# EAGLE board Trackerv4 (EAGLE 9.4.2)
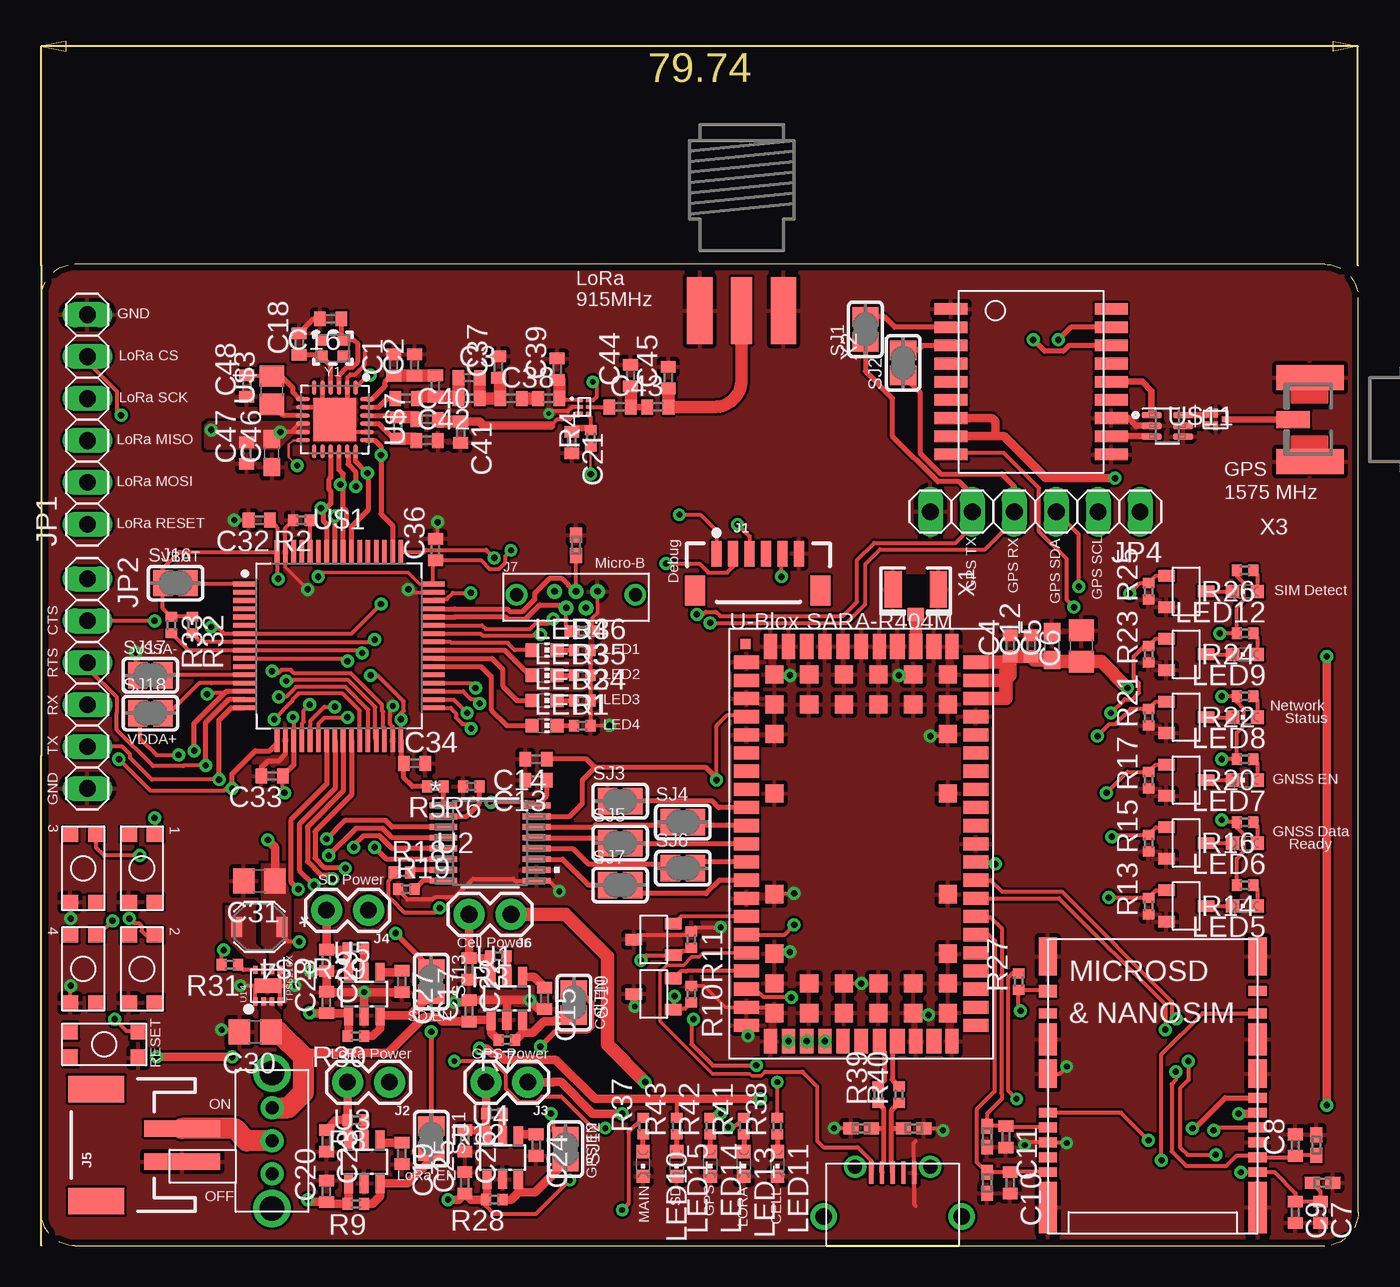
[diagram p5: board, top side]
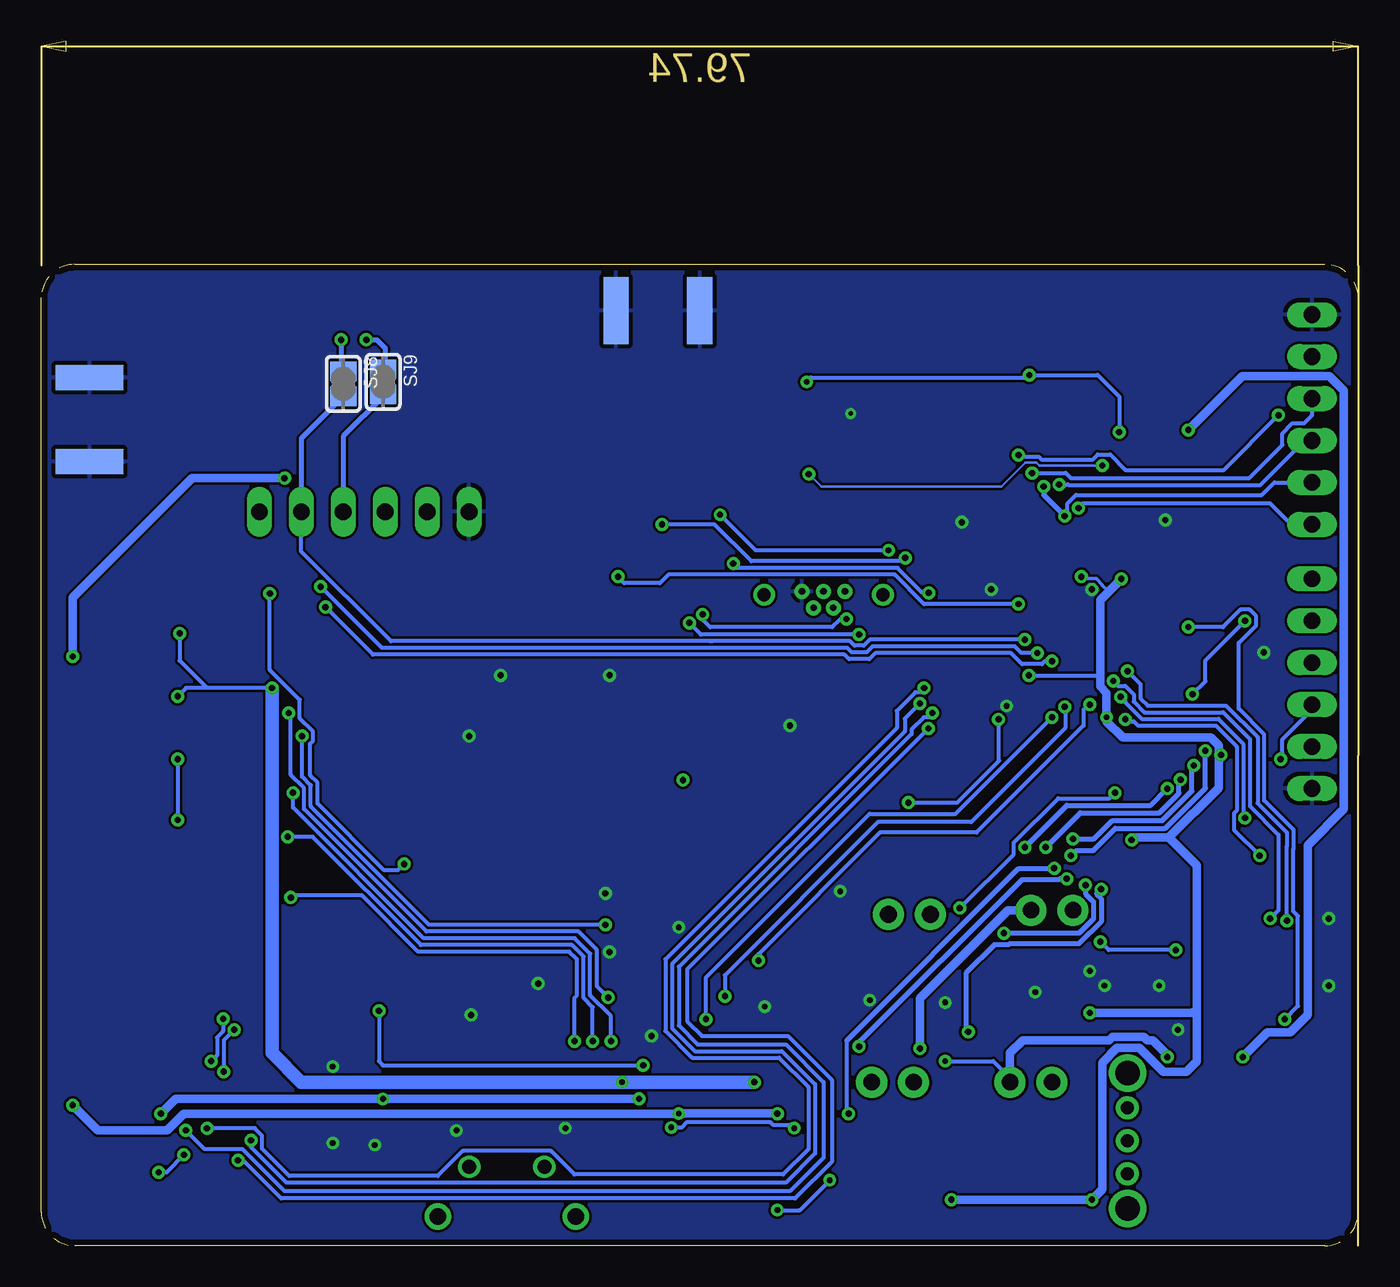
[diagram p6: board, bottom side, seen from below]

Size 79.76 x 59.44 mm. Coordinates in mm from the lower left corner, seen from the top.
Outline: 2.03,0 77.72,0 arc90 79.76,2.03 79.76,57.4 arc90 77.72,59.44 2.03,59.44 arc90 0,57.4 0,2.03 arc90 2.03,0
Copper layers (1*16): Top 0.035mm / dielectric 1.5mm / Bottom 0.035mm
Design rules "default *": minimum track width 6mil, minimum drill 0.35mm, track to track 6mil, track to pad 6mil, pad to pad 6mil, via to via 6mil, smd to smd 6mil, copper to edge 15mil, drill to drill 6mil, minimum pad ring 10mil, minimum via ring 8mil, stop-mask expansion 4mil, vias tented up to drill 0mil, thermal gap 10mil
Net classes: 1 diff: width 0.305 mm, clearance 0.152 mm

## Footprints (pad centres in the part's own frame; a part is rotated, then mirrored left to right if it is on the bottom)
C0402 = smd 0.7 x 0.9: 1 -0.65,0; 2 0.65,0
C0603 = smd 1.1 x 1: 1 -0.85,0; 2 0.85,0
C0805 = smd 1.3 x 1.5: 1 -0.95,0; 2 0.95,0
PESD0402 = smd 0.902 x 0.711: 1 -0.629,0; 2 0.629,0
JST-6-SMD-VERT-1.0MM = smd 0.6 x 1.55: 1 -2.54,1.27; 2 -1.54,1.27; 3 -0.54,1.27; 4 0.46,1.27; 5 1.46,1.27; 6 2.46,1.27 | smd 1.2 x 1.8: P$1 -3.84,-0.955; P$2 3.76,-0.955
1X02 = drill 1.016 pad 1.88: 1 0,0; 2 2.54,0
JST-2-SMD = smd 1 x 4.6: 1 -1,-3.7; 2 1,-3.7 | smd 1.6 x 3.4: NC1 -3.4,1.5; NC2 3.4,1.5
MICRO_USB_VERTICAL = drill 0.4: 1 -1.3,0; 2 -0.6,-1; 3 0,0; 4 0.6,-1; 5 1.3,0 | drill 0.8: 6 -3.6,-0.2; 7 3.6,-0.2
1X06 = drill 1.016 long: 1 -6.35,0; 2 -3.81,0; 3 -1.27,0; 4 1.27,0; 5 3.81,0; 6 6.35,0
CHIP-LED0603 = smd 0.8 x 0.8: A 0,-0.75; C 0,0.75
CHIPLED_0603 = smd 0.8 x 0.8: A 0,-0.75; C 0,0.75
SOT23-3 = smd 0.7 x 1: 1 -0.95,-1.2; 2 0.95,-1.2; 3 0,1.2
R0402 = smd 0.6 x 0.7: 1 -0.5,0; 2 0.5,0
KMR731NG = smd 0.9 x 1: P$1 -2.05,0.8; P$2 2.05,0.8; P$3 2.05,-0.8; P$4 -2.05,-0.8
SOLDERJUMPER_CLOSEDWIRE = smd 1.168 x 1.6: 1 -0.762,0; 2 0.762,0 | smd 0.635 x 0.203: WIRE 0,0
SOLDERJUMPER_REFLOW = smd 1.168 x 1.6: 1 -0.762,0; 2 0.762,0
SOLDERJUMPER_REFLOW_NOPASTE = smd 1.168 x 1.6: 1 -0.762,0; 2 0.762,0
SOT23-6 = smd 0.55 x 1.2: 1 -0.95,-1.3; 2 0,-1.3; 3 0.95,-1.3; 4 0.95,1.3; 5 0,1.3; 6 -0.95,1.3
PW16 = smd 1.676 x 0.356: 1 -2.819,2.275; 2 -2.819,1.625; 3 -2.819,0.975; 4 -2.819,0.325; 5 -2.819,-0.325; 6 -2.819,-0.975; 7 -2.819,-1.625; 8 -2.819,-2.275; 9 2.819,-2.275; 10 2.819,-1.625; 11 2.819,-0.975; 12 2.819,-0.325; 13 2.819,0.325; 14 2.819,0.975; 15 2.819,1.625; 16 2.819,2.275
SARA-R404M = smd 1.5 x 0.8: 1 1.05,-2; 2 1.05,-3.1; 3 1.05,-4.2; 4 1.05,-5.3; 5 1.05,-6.4; 6 1.05,-7.5; 7 1.05,-8.6; 8 1.05,-9.7; 9 1.05,-10.8; 10 1.05,-11.9; 11 1.05,-13; 12 1.05,-14.1; 13 1.05,-15.2; 14 1.05,-16.3; 15 1.05,-17.4; 16 1.05,-18.5; 17 1.05,-19.6; 18 1.05,-20.7; 19 1.05,-21.8; 20 1.05,-22.9; 21 1.05,-24; 33 14.95,-24; 34 14.95,-22.9; 35 14.95,-21.8; 36 14.95,-20.7; 37 14.95,-19.6; 38 14.95,-18.5; 39 14.95,-17.4; 40 14.95,-16.3; 41 14.95,-15.2; 42 14.95,-14.1; 43 14.95,-13; 44 14.95,-11.9; 45 14.95,-10.8; 46 14.95,-9.7; 47 14.95,-8.6; 48 14.95,-7.5; 49 14.95,-6.4; 50 14.95,-5.3; 51 14.95,-4.2; 52 14.95,-3.1; 53 14.95,-2 | smd 0.8 x 1.5: 22 2.5,-24.95; 23 3.6,-24.95; 24 4.7,-24.95; 25 5.8,-24.95; 26 6.9,-24.95; 27 8,-24.95; 28 9.1,-24.95; 30 11.3,-24.95; 32 13.5,-24.95; 54 13.5,-1.05; 56 11.3,-1.05; 58 9.1,-1.05; 59 8,-1.05; 60 6.9,-1.05; 61 5.8,-1.05; 62 4.7,-1.05; 63 3.6,-1.05; 64 2.5,-1.05 | smd 0.9 x 1.5: 29 10.2,-24.95; 31 12.4,-24.95; 55 12.4,-1.05; 57 10.2,-1.05 | smd 1.1 x 1.1: 65 2.75,-2.75; 66 4.85,-2.75; 67 6.95,-2.75; 68 9.05,-2.75; 69 11.15,-2.75; 70 13.25,-2.75; 71 2.75,-4.55; 72 4.85,-4.55; 73 6.95,-4.55; 74 9.05,-4.55; 75 11.15,-4.55; 76 13.25,-4.55; 77 2.75,-6.35; 78 13.25,-6.35; 79 2.75,-9.95; 80 13.25,-9.95; 81 2.75,-16.05; 82 13.25,-16.05; 83 2.75,-19.65; 84 13.25,-19.65; 85 2.75,-21.45; 86 4.85,-21.45; 87 6.95,-21.45; 88 9.05,-21.45; 89 11.15,-21.45; 90 13.25,-21.45; 91 2.75,-23.25; 92 4.85,-23.25; 93 6.95,-23.25; 94 9.05,-23.25; 95 11.15,-23.25; 96 13.25,-23.25 | smd 0.6 x 0.6: P$1 1,-0.9
8WSON = smd 0.5 x 0.28: P$1 -0.95,0.75; P$2 -0.95,0.25; P$3 -0.95,-0.25; P$4 -0.95,-0.75; P$5 0.95,-0.75; P$6 0.95,-0.25; P$7 0.95,0.25; P$8 0.95,0.75 | smd 0.9 x 1.6: P$9 0,0
QFP50P1200X1200X160-64 = smd 1.412 x 0.28: 1 -5.7,3.75; 2 -5.7,3.25; 3 -5.7,2.75; 4 -5.7,2.25; 5 -5.7,1.75; 6 -5.7,1.25; 7 -5.7,0.75; 8 -5.7,0.25; 9 -5.7,-0.25; 10 -5.7,-0.75; 11 -5.7,-1.25; 12 -5.7,-1.75; 13 -5.7,-2.25; 14 -5.7,-2.75; 15 -5.7,-3.25; 16 -5.7,-3.75; 33 5.7,-3.75; 34 5.7,-3.25; 35 5.7,-2.75; 36 5.7,-2.25; 37 5.7,-1.75; 38 5.7,-1.25; 39 5.7,-0.75; 40 5.7,-0.25; 41 5.7,0.25; 42 5.7,0.75; 43 5.7,1.25; 44 5.7,1.75; 45 5.7,2.25; 46 5.7,2.75; 47 5.7,3.25; 48 5.7,3.75 | smd 0.28 x 1.412: 17 -3.75,-5.7; 18 -3.25,-5.7; 19 -2.75,-5.7; 20 -2.25,-5.7; 21 -1.75,-5.7; 22 -1.25,-5.7; 23 -0.75,-5.7; 24 -0.25,-5.7; 25 0.25,-5.7; 26 0.75,-5.7; 27 1.25,-5.7; 28 1.75,-5.7; 29 2.25,-5.7; 30 2.75,-5.7; 31 3.25,-5.7; 32 3.75,-5.7; 49 3.75,5.7; 50 3.25,5.7; 51 2.75,5.7; 52 2.25,5.7; 53 1.75,5.7; 54 1.25,5.7; 55 0.75,5.7; 56 0.25,5.7; 57 -0.25,5.7; 58 -0.75,5.7; 59 -1.25,5.7; 60 -1.75,5.7; 61 -2.25,5.7; 62 -2.75,5.7; 63 -3.25,5.7; 64 -3.75,5.7
AFS14 = smd 0.425 x 0.325: P$1 -0.588,0; P$4 0.588,-0.287; P$5 0.588,0.287 | smd 0.25 x 0.525: P$2 0,-0.388; P$3 0,0.388
C0805' = smd 1.3 x 1.5: 1 -0.85,0; 2 0.85,0
IND_3010 = smd 0.65 x 1.2: 1 -1.375,0; 2 1.375,0
SIM_SD_MOLEX = smd 1.1 x 0.6: C1 6.35,3.7; C2 6.35,4.6; C3 -6.35,3.7; C5 6.35,5.5; C6 -6.35,4.6; C7 -6.35,6.4; T1 6.35,14.665; T2 6.35,13.31; T3 6.35,8.2; T4 6.35,7.3; T5 6.35,6.4; T6 -6.35,5.5; T7 -6.35,7.3; T8 -6.35,13.31 | smd 1.1 x 3.1: G1 -6.35,1.55; G8 6.35,1.55 | smd 1.1 x 1.72: G2 -6.35,9.66; G7 6.35,9.66 | smd 1.1 x 1.94: G3 -6.35,11.74; G6 6.35,11.74 | smd 1.1 x 2.3: G4 -6.35,16.75; G5 6.35,16.75 | smd 1.1 x 0.75: SW -6.35,14.665
MOLEX_USB = smd 0.25 x 1.35: P$1 -1.3,2.65; P$2 -0.65,2.65; P$3 0,2.65; P$4 0.65,2.65; P$5 1.3,2.65 | drill 0.85 pad 1.206: P$6 -2.276,3; P$7 2.276,3 | drill 1 pad 1.6: P$8 -4.175,0; P$9 4.175,0
QFN50P400X400X100-25T260 = smd 0.86 x 0.27: 1 -1.935,1.25; 2 -1.935,0.75; 3 -1.935,0.25; 4 -1.935,-0.25; 5 -1.935,-0.75; 6 -1.935,-1.25; 13 1.935,-1.25; 14 1.935,-0.75; 15 1.935,-0.25; 16 1.935,0.25; 17 1.935,0.75; 18 1.935,1.25 | smd 0.27 x 0.86: 7 -1.25,-1.935; 8 -0.75,-1.935; 9 -0.25,-1.935; 10 0.25,-1.935; 11 0.75,-1.935; 12 1.25,-1.935; 19 1.25,1.935; 20 0.75,1.935; 21 0.25,1.935; 22 -0.25,1.935; 23 -0.75,1.935; 24 -1.25,1.935 | smd 2.6 x 2.6: 25 0,0
MAX-8-M8 = smd 2 x 0.7: P$1 -4.85,4.4; P$2 -4.85,3.3; P$3 -4.85,2.2; P$4 -4.85,1.1; P$5 -4.85,0; P$6 -4.85,-1.1; P$7 -4.85,-2.2; P$8 -4.85,-3.3; P$9 -4.85,-4.4; P$10 4.85,-4.4; P$11 4.85,-3.3; P$12 4.85,-2.2; P$13 4.85,-1.1; P$14 4.85,0; P$15 4.85,1.1; P$16 4.85,2.2; P$17 4.85,3.3; P$18 4.85,4.4
TSNP-6-8 = smd 0.2 x 0.2: P$1 -0.2,0.4; P$2 -0.2,0; P$3 -0.2,-0.4; P$4 0.2,-0.4; P$5 0.2,0; P$6 0.2,0.4
0402 = smd 0.7 x 0.9: 1 -0.65,0; 2 0.65,0
SOT363_6SOIC = smd 1.19 x 0.4: 1 -0.96,0.65; 2 -0.96,0; 3 -0.96,-0.65; 4 0.96,-0.65; 5 0.96,0; 6 0.96,0.65
SPDT_THRU = drill 0.787 pad 1.397: 1 -2.007,0; 2 0,0; 3 2.007,0 | drill 1.499: A1 -4.102,0; A2 4.102,0
U.FL = smd 2.2 x 1.05: 1 0,1.375; 2 0,-1.375 | smd 0.8 x 1: 3 1.525,0
SMA_EDGELAUNCH = smd 4.064 x 1.524: GND@1 2.032,-2.54; GND@2 2.032,2.54 | smd 4.064 x 1.524 bottom: GND@3 2.032,2.54; GND@4 2.032,-2.54 | smd 4.064 x 1.27: P 2.032,0
SMA_EDGELAUNCH_UFL = smd 4.064 x 1.524: GND@1 2.032,-2.54; GND@2 2.032,2.54 | smd 4.064 x 1.524 bottom: GND@3 2.032,2.54; GND@4 2.032,-2.54 | smd 2.032 x 1.016: P 3.048,0
CRYSTAL-SMD-2.0X1.6MM = smd 0.75 x 0.7: 1 -0.675,-0.5; 2 0.675,-0.5; 3 0.675,0.5; 4 -0.675,0.5

## Placement (x,y rotation side)
C1  47nF  [C0402]  21.34,53.34 90 top
C2  47pF  [C0402]  22.61,53.34 90 top
C3  3pF  [C0402]  25.91,52.58 0 top
C4  0.1uF  [C0402]  58.67,36.32 90 top
C5  10uF  [C0603]  61.21,36.32 90 top
C6  22uF  [C0805]  62.99,36.32 90 top
C7  47pF  [C0402]  77.47,2.03 270 top
C8  47pF  [C0402]  75.95,6.1 90 top
C9  100nF  [C0402]  75.95,2.03 270 top
C10  47pF  [C0402]  58.67,3.81 270 top
C11  47pF  [C0402]  58.42,6.6 270 top
C12  1uF  [C0402]  59.94,36.32 90 top
C13  0.1uF  [C0402]  29.97,28.19 180 top
C14  0.1uF  [C0402]  29.97,29.46 180 top
C15  0.1uF  [C0402]  30.48,14.99 270 top
C16  6pF  [C0402]  17.53,56.13 180 top
C17  1uF  [C0402]  25.91,14.22 90 top
C18  6pF  [C0402]  15.62,54.61 90 top
C19  0.1uF  [C0402]  21.84,5.59 270 top
C20  1uF  [C0402]  17.27,3.3 90 top
C21  10nF  [C0402]  32.13,48.64 270 top
C22  1uF  [C0402]  25.91,16.76 270 top
C23  1uF  [C0402]  17.27,6.35 270 top
C24  0.1uF  [C0402]  29.97,6.1 270 top
C25  1uF  [C0402]  25.65,3.81 90 top
C26  1uF  [C0402]  25.65,6.35 270 top
C27  0.1uF  [C0402]  21.84,16 270 top
C28  1uF  [C0402]  17.27,14.73 90 top
C29  1uF  [C0402]  17.27,17.27 270 top
C30  10uF  [C0805]  12.95,12.95 180 top
C31  10uF  [C0805]  13.21,22.1 180 top
C32  0.1uF  [C0402]  13.21,43.94 180 top
C33  0.1uF  [C0402]  13.97,28.45 180 top
C34  0.1uF  [C0402]  22.61,29.21 0 top
C36  0.1uF  [C0402]  23.88,42.16 90 top
C37  5.6pF  [C0402]  27.69,53.21 90 top
C38  39pF  [C0402]  28.45,51.31 0 top
C39  1.8pF  [C0402]  31.24,53.09 90 top
C40  2.4pF  [C0402]  23.37,50.04 0 top
C41  dnp  [C0402]  25.4,49.28 270 top
C42  1.8pF  [C0402]  23.37,48.77 0 top
C43  39pF  [C0402]  35.05,50.8 0 top
C44  3.3pF  [C0402]  35.69,52.7 90 top
C45  3.3pF  [C0402]  37.97,52.58 90 top
C46  1uF  [C0603]  13.97,48.01 90 top
C47  0.1uF  [C0402]  12.45,48.01 90 top
C48  0.1uF  [C0402]  12.45,52.07 90 top
CR1  PESD0402-140  [PESD0402]  77.6,3.81 180 top
CR2  PESD0402-140  [PESD0402]  77.22,6.1 270 top
CR3  PESD0402-140  [PESD0402]  57.28,3.81 90 top
CR4  PESD0402-140  [PESD0402]  57.28,6.6 90 top
CR5  PESD0402-140  [PESD0402]  52.83,7.11 180 top
CR6  PESD0402-140  [PESD0402]  49.66,7.11 0 top
CR7  PESD0402-140  [PESD0402]  32.77,37.21 180 top
CR8  PESD0402-140  [PESD0402]  32.38,42.42 270 top
J1  JST_6_PIN_VERTICAL  [JST-6-SMD-VERT-1.0MM]  43.43,40.64 0 top
J2  [1X02]  21.08,9.91 180 top
J3  [1X02]  29.46,9.91 180 top
J4  [1X02]  19.81,20.32 180 top
J5  [JST-2-SMD]  4.83,6.1 90 top
J6  [1X02]  28.45,20.07 180 top
J7  MICRO_USB_VERTICAL  [MICRO_USB_VERTICAL]  32.38,39.62 0 top
JP1  [1X06]  2.79,50.04 90 top
JP2  [1X06]  2.79,34.04 270 top
JP4  [1X06]  60.2,44.45 180 top
LED1  [CHIP-LED0603]  30.48,31.5 270 top
LED2  [CHIP-LED0603]  30.48,33.02 270 top
LED3  [CHIP-LED0603]  30.48,34.54 270 top
LED4  [CHIP-LED0603]  30.48,36.07 270 top
LED5  [CHIPLED_0603]  72.9,20.57 90 top
LED6  [CHIPLED_0603]  72.9,24.38 90 top
LED7  [CHIPLED_0603]  72.9,28.19 90 top
LED8  [CHIPLED_0603]  72.9,32 90 top
LED9  [CHIPLED_0603]  72.9,35.81 90 top
LED10  [CHIPLED_0603]  36.45,4.95 180 top
LED11  [CHIPLED_0603]  44.58,4.95 180 top
LED12  [CHIPLED_0603]  72.9,39.62 90 top
LED13  [CHIPLED_0603]  42.55,4.95 180 top
LED14  [CHIPLED_0603]  40.51,4.95 180 top
LED15  [CHIPLED_0603]  38.48,4.95 180 top
Q1  BSS138  [SOT23-3]  37.08,15.24 90 top
Q2  BSS138  [SOT23-3]  37.08,18.54 90 top
R1  100k  [R0402]  32.77,31.5 0 top
R2  100k  [R0402]  15.75,43.94 180 top
R3  100k  [R0402]  27.69,17.53 180 top
R4  100  [R0402]  33.27,48.9 90 top
R5  0  [R0402]  23.88,27.81 180 top
R6  0  [R0402]  26.04,27.81 180 top
R7  100k-dnp  [R0402]  28.19,12.45 180 top
R8  100k  [R0402]  19.05,7.62 180 top
R9  100k-dnp  [R0402]  19.05,2.54 180 top
R10  1M  [R0402]  39.37,15.24 270 top
R11  1M  [R0402]  39.37,18.54 270 top
R12  100k  [R0402]  27.43,8 180 top
R13  10k  [R0402]  67.06,20.57 90 top
R14  330  [R0402]  72.9,21.84 180 top
R15  10k  [R0402]  67.06,24.38 90 top
R16  330  [R0402]  72.9,25.65 180 top
R17  10k  [R0402]  67.06,28.19 90 top
R18  0  [R0402]  21.84,22.61 0 top
R19  0  [R0402]  22.1,21.59 0 top
R20  330  [R0402]  72.9,29.46 180 top
R21  10k  [R0402]  67.06,32 90 top
R22  330  [R0402]  72.9,33.27 180 top
R23  10k  [R0402]  67.06,35.81 90 top
R24  330  [R0402]  72.9,37.08 180 top
R25  10k  [R0402]  67.06,39.62 90 top
R26  330  [R0402]  72.9,40.89 180 top
R27  100k  [R0402]  59.18,16 90 top
R28  100k-dnp  [R0402]  27.43,2.79 180 top
R29  100k  [R0402]  19.05,18.03 180 top
R30  100k-dnp  [R0402]  19.05,12.7 180 top
R31  100k  [R0402]  11.43,17.02 180 top
R32  4.7k  [R0402]  9.14,37.59 270 top
R33  4.7k  [R0402]  7.87,37.59 270 top
R34  100k  [R0402]  32.77,33.02 0 top
R35  100k  [R0402]  32.77,34.54 0 top
R36  100k  [R0402]  32.77,36.07 0 top
R37  330  [R0402]  36.45,7.24 90 top
R38  330  [R0402]  44.58,7.24 90 top
R39  29  [R0402]  50.67,9.14 90 top
R40  29  [R0402]  51.94,9.14 90 top
R41  330  [R0402]  42.55,7.24 90 top
R42  330  [R0402]  40.51,7.24 90 top
R43  330  [R0402]  38.48,7.24 90 top
S1  KMR731NG  [KMR731NG]  3.81,12.19 180 top
S2  KMR731NG  [KMR731NG]  2.54,16.76 90 top
S3  KMR731NG  [KMR731NG]  6.1,16.76 90 top
S4  KMR731NG  [KMR731NG]  6.1,22.86 90 top
S5  KMR731NG  [KMR731NG]  2.54,22.86 90 top
SJ1  [SOLDERJUMPER_CLOSEDWIRE]  49.91,55.5 90 top
SJ2  [SOLDERJUMPER_CLOSEDWIRE]  52.2,53.47 90 top
SJ3  [SOLDERJUMPER_CLOSEDWIRE]  35.05,26.92 0 top
SJ4  [SOLDERJUMPER_CLOSEDWIRE]  38.86,25.65 0 top
SJ5  [SOLDERJUMPER_CLOSEDWIRE]  35.05,24.38 0 top
SJ6  [SOLDERJUMPER_CLOSEDWIRE]  38.86,22.86 0 top
SJ7  [SOLDERJUMPER_CLOSEDWIRE]  35.05,21.84 0 top
SJ8  [SOLDERJUMPER_REFLOW]  61.47,52.2 270 bottom
SJ9  [SOLDERJUMPER_REFLOW]  59.05,52.32 270 bottom
SJ10  [SOLDERJUMPER_CLOSEDWIRE]  32.26,14.73 270 top
SJ11  [SOLDERJUMPER_CLOSEDWIRE]  23.62,6.48 270 top
SJ12  [SOLDERJUMPER_CLOSEDWIRE]  31.75,5.84 270 top
SJ13  [SOLDERJUMPER_CLOSEDWIRE]  23.62,16 270 top
SJ16  [SOLDERJUMPER_REFLOW_NOPASTE]  8.13,40.13 0 top
SJ17  [SOLDERJUMPER_REFLOW_NOPASTE]  6.6,34.54 0 top
SJ18  [SOLDERJUMPER_REFLOW_NOPASTE]  6.6,32.26 0 top
U1  TPS22917  [SOT23-6]  28.19,14.99 0 top
U2  SN74AVC4T774PWR  [PW16]  27.18,24.38 0 top
U3  TPS22917  [SOT23-6]  19.56,5.08 0 top
U4  TPS22917  [SOT23-6]  27.94,5.33 0 top
U5  TPS22917  [SOT23-6]  19.56,15.24 0 top
U6  SARA-R404M  [SARA-R404M]  41.66,37.34 0 top
U7  BSS138  [SOT23-3]  69.34,20.57 270 top
U8  BSS138  [SOT23-3]  69.34,24.38 270 top
U9  BSS138  [SOT23-3]  69.34,28.19 270 top
U10  BSS138  [SOT23-3]  69.34,32 270 top
U11  BSS138  [SOT23-3]  69.34,35.81 270 top
U12  BSS138  [SOT23-3]  69.34,39.62 270 top
U14  TPS6216X  [8WSON]  13.72,15.75 90 top
U$1  STM32L422RBT6  [QFP50P1200X1200X160-64]  18.03,36.32 0 top
U$2  AFS14AFS14A04-1575.42-T3  [AFS14]  71.12,50.04 180 top
U$3  MLZ2012N150L  [C0805']  13.97,51.82 90 top
U$4  VLF3012ST-2R2M1R4  [IND_3010]  13.21,19.3 180 top
U$5  SIM_SD_MOLEX  [SIM_SD_MOLEX]  67.31,0.76 0 top
U$6  MICRO_USB  [MOLEX_USB]  51.56,1.78 0 top
U$7  SX1262  [QFN50P400X400X100-25T260]  17.78,50.04 270 top
U$8  MAX-8/M8  [MAX-8-M8]  59.94,52.32 0 top
U$9  BGS12SN6E6327XTSA1  [TSNP-6-8]  32.89,50.8 0 top
U$10  47nH  [0402]  23.88,52.07 270 top
U$11  BGA2803  [SOT363_6SOIC]  68.2,49.66 0 top
U$12  2.5nH  [0402]  25.91,51.31 0 top
U$13  4.7nH  [0402]  30.73,51.31 0 top
U$14  15nH  [0402]  21.59,49.53 90 top
U$15  9.1nH  [0402]  37.34,50.8 0 top
U$16  0R  [0402]  22.1,51.31 0 top
U$17  SPDT_THRU  [SPDT_THRU]  13.97,6.35 270 top
X1  [U.FL]  52.96,39.75 270 top
X2  [SMA_EDGELAUNCH]  42.42,58.67 270 top
X3  [SMA_EDGELAUNCH_UFL]  78.87,50.04 180 top
Y1  XRCGB32M000F2P00R0  [CRYSTAL-SMD-2.0X1.6MM]  17.65,54.36 180 top

## Tracks (layer width: path | path; a pad name or v marks a point on that pad's centre or on a via)
!CELL_RESET  (via drill 0.38)
  Top 0.254: v17.78,32.64 17.14,32.64 16.3,31.8 16.3,31.56 16.28,31.54 U$1.21 | v38.35,15.11 38.35,14.36 | 38.35,14.36 Q1.1 | R10.2 38.99,14.36 38.35,14.36
  Bottom 0.254: v17.78,32.64 17.74,32.6 17.74,31.34 23.43,25.65 29.08,25.65 38.35,16.38 v38.35,15.11
!GPS_RESET  (via drill 0.38)
  Top 0.254: U$1.10 18.37,35.57 v18.54,35.4 | v62.55,38.67 62.1,39.12 62.1,41.58 60.43,43.26 60.43,45.87 58.29,48.01 55.18,48.01 U$8.P$9
  Bottom 0.254: v18.54,35.4 18.98,35.4 19.15,35.23 20.37,35.23 21.03,35.89 29.25,35.89 29.61,35.53 30.84,35.53 31.11,35.8 59.67,35.8 v62.55,38.67
!LORA_RESET  (via drill 0.38)
  Top 0.254: v16.93,44.68 17.08,44.53 17.08,44.48
  Top 0.305: U$1.58 17.28,43.7 17.08,43.91 17.08,44.48 17.53,44.93 17.53,45.69 17.41,45.81 17.41,46.39 17.53,46.51 U$7.15
  Bottom 0.254: JP1.1 4.06,43.69 5.33,44.96 16.65,44.96 v16.93,44.68
+3V3_GPS  (via drill 0.35, 0.38)
  Top 0.254: R42.2 40.77,8 v41.15,8
  Top 0.508: v77.85,8.51 v77.85,35.69 | v65.02,46.48 60.83,46.48 58.29,49.02 57.66,49.02 | 57.66,49.02 U$8.P$8 | U$8.P$7 57.57,50.12 57.78,49.91 57.78,49.15 57.66,49.02 | v35.18,8 33.39,8 31.46,9.93 31.02,9.93 31,9.91 J3.1
  Bottom 0.508: v77.85,8.51 76.33,6.99 72.14,6.99 71.12,8 v41.15,8 40.89,8 40.86,8.03 35.4,8.03 35.38,8 v35.18,8 | v77.85,35.69 77.85,39.24 70.61,46.48 v65.02,46.48
+3V3_LORA  (via drill 0.35, 0.38)
  Top 0.254: U$7.1 19.78,52.73 v19.92,52.73 | 14.35,49.28 v14.48,49.28 15.11,49.28 | R41.2 42.12,7.32 42.08,7.32 41.93,7.17 v41.6,7.17 | v34.16,7.11 33.4,7.11 31.5,9.02 30.3,9.02 29.97,8.69 28.96,8.69 28.14,9.5 28.14,10.41 27.43,11.12 26.52,11.12 26.47,11.18 v25.02,11.18 | U$9.P$6 33.42,51.2 33.66,51.44 33.66,52.07 v33.4,52.32 | U$7.11 15.83,49.28 15.11,49.28 | U$7.10 15.62,49.79 15.11,49.28
  Top 0.508: v11.56,11.43 v6.99,11.43 | v10.29,49.4 10.41,49.28
  Bottom 0.254: v14.48,49.28 14.48,51.44 15.77,52.73 v19.92,52.73 20.07,52.58 33.15,52.58 v33.4,52.32 | v41.6,7.17 40.97,7.17 40.64,7.49 35.62,7.49 35.46,7.33 34.38,7.33 v34.16,7.11 | v25.02,11.18 22.1,11.18 21.08,10.16
  Bottom 0.508: J2.1 21.08,10.16 21.08,11.68 20.32,12.45 15.07,12.45 14.88,12.64 12.98,12.64 12.78,12.45 12.45,12.45 11.56,11.56 v11.56,11.43 | v6.99,11.43 5.5,12.92 4.11,12.92 3.05,13.98 3.05,24.26 0.86,26.44 0.86,51.79 1.75,52.68 7.01,52.68 v10.29,49.4
  pour Top (no thermals): 16.26,49.15 16.26,49.91 10.16,49.91 9.91,49.66 9.91,48.39 10.03,48.26 14.35,48.26 15.24,49.15
+3V3_MAIN  (via drill 0.35, 0.38)
  Top 0.203: U$1.48 22.92,40.07 22.23,40.77 17.02,40.77 v16.76,40.51
  Top 0.254: U$1.64 14.28,43.52 C32.1 | R31.2 10.93,17.79 v11.05,17.91 | v15.62,18.41 14.99,18.41 14.61,18.8 | U$1.48 23.73,41.37 C36.1 26.62,41.51 27.15,40.98 27.71,40.98 28.11,41.38 28.11,41.77 v28.45,42.11 | R32.1 R33.1 7.37,38.6 SJ16.1 7.37,41.02 8.37,42.02 U$1.64 | U$1.32 v21.78,31.88 21.78,32.25 21.95,32.41 21.95,32.96 20.37,34.54 v19.94,34.54 | U$1.64 14.28,40.45 v14.35,40.39 | 8.38,29.72 v8.31,29.72 6.99,29.72 5.97,30.73 5.97,32.13 SJ18.1 | R18.1 21.34,22.38 21.02,22.06 21.02,21.12 21.18,20.96 21.2,20.96 21.97,20.19 23.88,20.19 v24.13,20.45 | v14.73,27.43 14.62,27.54 C33.1 | U2.16 29.82,26.84 v27.24,26.84 | v38.65,44.28 39.92,44.28 40.89,43.31 J1.1 | U$1.19 15.28,31.96 v15.24,32 | R37.2 36.03,7.32 35.98,7.32 35.56,6.89 35.56,2.54 v35.18,2.16 | v32,3.96 29.94,1.91 27.43,1.91 26.93,2.4 R28.2
  Top 0.305: 23.25,27.69 R5.2 22.48,27.81 21.96,28.34 C34.1 21.78,29.38 U$1.32 | U$1.19 15.28,29.11 C33.1 | U2.16 30.62,27.28 C13.1
  Top 0.508: U4.1 26.99,2.85 R28.2 26.02,2.79 C25.1 25.29,2.79 v24.64,2.79 | U3.1 18.61,2.6 R9.2 17.38,2.54 C20.1 16.27,2.65 v16.13,2.79 | R30.2 18.61,12.76 U5.1 18.47,14.08 C28.1 16.27,14.08 v16.26,14.1 | C31.1 14.16,24.13 v13.72,24.57
  Bottom 0.203: v16.76,40.51 16.65,40.4 15.86,40.4 15.48,40.02 15.48,39.99 15.11,39.62
  Bottom 0.254: v11.05,17.91 15.11,17.91 v15.62,18.41 | v19.94,34.54 15.63,34.54 | 8.45,29.72 v8.31,29.72 | v24.13,20.45 20.87,23.71 20.87,24.41 18.17,27.1 15.06,27.1 v14.73,27.43 | v27.24,26.84 24.29,26.84 21.75,29.37 21.75,31.84 v21.78,31.88 | v28.45,42.11 36.48,42.11 v38.65,44.28 | v35.18,2.16 33.81,2.16 v32,3.96
  Bottom 0.508: v13.72,24.57 13.58,24.71 11.46,24.71 | 11.46,24.71 8.45,27.72 8.45,29.72 8.45,30.3 8.92,30.77 14.26,30.77 15.24,31.75 v15.24,32 15.24,33.48 15.63,33.86 15.63,34.54 15.63,39.11 15.11,39.62 v14.35,40.39 | 9.78,14.35 9.78,11.18 10.41,10.54 11.81,10.54 13.25,11.98 14.6,11.98 15.5,11.09 15.5,3.42 v16.13,2.79 v24.64,2.79 | 9.78,14.35 9.78,23.04 11.46,24.71 | v16.26,14.1 10.03,14.1 9.78,14.35
  pour Top (no thermals): 13.84,16.38 14.1,16.38 14.1,17.02 15.11,18.03 15.11,23.11 13.34,23.11 13.34,18.29 13.84,17.78
+3V3_SD  (via drill 0.35, 0.38)
  Top 0.254: 38.48,8.89 R43.2 | R27.2 58.82,16.5 58.55,16.23 58.55,9.4 v59.05,8.89
  Top 0.508: v26.54,11.94 26.98,11.94 27.26,11.66 27.65,11.66 28.04,11.27 31.15,11.27 33.53,8.89 38.48,8.89 v43.56,8.89 | v72.52,8 73.6,8 U$5.T4
  Bottom 0.508: J4.1 21.21,20.32 26.54,14.99 v26.54,11.94 | v43.56,8.89 v59.05,8.89 71.63,8.89 v72.52,8
+3V7_CELL  (via drill 0.35, 0.38)
  Top 0.254: v71.37,37.08 R24.2 72.4,38.68 72.83,39.11 72.83,40.14 72.4,40.57 R26.2 | v71.5,33.27 R22.2 72.4,32.95 72.83,32.52 72.83,31.49 72.4,31.06 R20.2 v71.5,29.46 | v71.5,25.78 71.63,25.65 R16.2 72.4,25.33 72.83,24.9 72.83,23.87 72.4,23.44 R14.2 | R38.2 v44.58,9.91
  Top 0.813: J6.1 31.75,20.07 34.29,17.53 34.29,12.19 v36.58,9.91 | v65.79,33.78 64.2,35.37 C6.1 61.31,35.37 C5.1 60.14,35.47 C12.1 C4.1 | U6.53 58.34,35.34 | 58.34,35.34 C4.1 | U6.52 58.37,34.24 | 58.37,34.24 58.42,34.29 | 58.42,34.29 58.42,35.26 58.34,35.34 | U6.51 58.41,33.14 58.42,33.15 58.42,34.19 58.37,34.24 | 58.42,34.29 58.67,34.54 C4.1
  Bottom 0.254: v71.37,37.08 71.37,35.43 69.72,33.78 | v65.79,33.78 69.72,33.78 | 69.72,33.78 70.99,33.78 v71.5,33.27 | v71.5,29.46 v71.5,25.78
  Bottom 0.813: v36.58,9.91 v44.58,9.91 64.01,9.91 65.79,11.68 v65.79,33.78
CELL_CTS  (via drill 0.38)
  Top 0.254: v6.86,37.85 JP2.2 | 11.1,33.48 10.11,33.48 v10.03,33.4
  Top 0.305: U2.4 21.25,24.71 20.67,25.29 19.06,25.29 v17.4,23.62 | U$1.14 11.21,33.58 11.1,33.48 9.25,31.63 v9.25,29.97
  Bottom 0.254: v6.86,37.85 9.25,35.45 9.25,34.18 v10.03,33.4
  Bottom 0.305: v17.4,23.62 17.08,23.94 16.05,23.94 14.72,25.27 11.69,25.27 9.25,27.71 v9.25,29.97
CELL_D_N
  Top 0.305: U$6.P$2 50.91,4.95 51.01,5.05 51.01,7.11 | R39.1 51.01,8.31 51.01,7.11 | CR6.2 51.01,7.11
CELL_D_P
  Top 0.305: U$6.P$3 51.56,4.95 51.47,5.05 51.47,7.11 | R40.1 51.47,8.17 51.47,7.11 | 51.47,7.11 CR5.2
CELL_POWER_EN  (via drill 0.38)
  Top 0.305: v17.65,22.23 17.41,22.47 16.92,22.47 16.12,23.27 16.12,25.38 18.28,27.54 U$1.25 | SJ10.1 32.4,15.35 32.69,15.35 33.36,14.68 33.36,13.26 33.12,13.02 31.18,13.02 v30.23,12.06
  Bottom 0.305: v17.65,22.23 18.06,22.23 18.13,22.16 20.37,22.16 30.23,12.3 v30.23,12.06
CELL_RTS  (via drill 0.38)
  Top 0.254: JP2.3 2.79,35 4.6,33.2 4.6,32.34 4.57,32.31 4.57,31.24 6.77,29.05 8.59,29.05 8.63,29.08 v9.95,29.08
  Top 0.305: U2.3 21.25,25.36 20.86,25.74 18.38,25.74 v17.27,24.64 | v9.95,29.08 9.95,31.68 11.34,33.07 U$1.15
  Bottom 0.305: v17.27,24.64 16,24.64 14.88,25.76 11.85,25.76 10.07,27.54 10.07,28.97 v9.95,29.08
CELL_RX  (via drill 0.38)
  Top 0.254: v11.56,27.69 11.18,27.69 11.04,27.55 6.61,27.55 v4.7,29.46
  Top 0.305: U2.6 20.91,23.41 v20.19,24.13 | v11.56,27.69 11.56,28.57 12.95,29.97 13.84,29.97 14.28,30.41 U$1.17
  Bottom 0.254: v4.7,29.46 4.6,29.57 4.6,30.66 2.79,32.46 JP2.4
  Bottom 0.305: v20.19,24.13 17.65,26.67 12.57,26.67 v11.56,27.69
CELL_TURN_ON  (via drill 0.38)
  Top 0.254: v36.32,17.27 36.64,17.59 Q2.1 38.6,17.59 38.88,17.87 39.2,17.87 R11.2 | U$1.20 15.78,31.62 15.9,31.73 15.9,32.41 v16.26,32.77
  Bottom 0.254: v16.26,32.77 16.32,32.77 16.64,32.45 16.64,31.5 23.11,25.02 28.96,25.02 36.32,17.65 v36.32,17.27
CELL_TX  (via drill 0.38)
  Top 0.254: v10.77,28.22 6.7,28.22 5.37,29.55 5.37,29.74 4.89,30.23 JP2.5
  Top 0.305: v18.92,24.13 18.92,24.23 19.52,24.83 20.48,24.83 21.25,24.06 U2.5 | v10.77,28.22 10.77,31.85 11.49,32.57 U$1.16
  Bottom 0.305: v18.92,24.13 16.84,26.21 12.04,26.21 10.86,27.4 10.86,28.13 v10.77,28.22
DIO2  (via drill 0.38)
  Top 0.152: U$7.12 15.82,48.77 15.24,48.77 14.99,48.51 14.99,47.75 v15.49,47.24 | v33.27,46.74 R4.1
  Bottom 0.152: v15.49,47.24 19.31,47.24 19.49,47.42 20.15,47.42 21.6,45.97 32.51,45.97 v33.27,46.74
GND  (via drill 0.25, 0.35, 0.38)
  Top 0.203: R10.1 40.14,15.74 41.44,14.44 U6.20 | U6.83 45.25,17.69 v45.34,17.78 | U6.87 49.64,15.89 v49.66,15.88 | U6.95 53.6,14.09 v53.72,13.97 | U6.21 42.8,13.24 v42.8,12.7 | U6.81 44.45,21.34 v45.59,21.34 | U6.78 54.78,30.86 v53.85,30.86 | U6.65 45.3,34.59 v45.34,34.54 | U6.69 52.76,34.54 v51.94,34.54 | R1.2 v34.42,31.5 | CR7.1 33.4,38.03 33.69,38.33 33.69,38.92 J7.5 | C36.2 24,42.94 v24,43.81 | U$1.47 22.4,39.57 v22.23,39.75 | U$1.63 14.78,41.1 v16.13,39.75 | C32.2 v11.68,43.94 | SJ17.1 5.71,34.67 v5.71,35.94 | S5.P$1 1.78,20.77 v1.78,19.81 | S2.P$1 1.74,15.71 v1.78,15.75
  Top 0.254: U$1.63 14.78,43.48 R2.2 | R36.2 R35.2 R34.2 R1.2 | U$7.2 18.54,51.98 18.54,52.58 18.73,52.77 19.01,52.77 19.61,53.37 19.61,54.1 | U$7.20 18.53,49.29 U$7.25 | U$1.31 21.28,31.43 21.11,31.6 21.11,32.51 v21.29,32.69 | R19.1 21.72,21.47 21.72,21.43 22.18,20.96 23.69,20.96 23.85,21.12 25.06,21.12 26.16,22.23 28.57,22.23 28.7,22.1 29.99,22.1 U2.9 30.72,22.11 v31.37,21.46 | 12.95,15.75 U14.P$9 14.48,15.75 | 12.95,15.75 v12.06,15.75 | 14.48,15.75 v15.37,15.75 | U14.P$5 14.48,16.69 14.48,15.75 | U14.P$4 14.47,15.74 14.48,15.75 | U14.P$1 12.97,15.74 12.95,15.75 | C30.2 11.88,13.08 v10.92,13.08 | U$5.G2 61.68,10.42 v62.1,10.84 | v62.1,6.22 62.06,6.26 U$5.T6 59.73,6.26 v59.56,6.1 | CR5.1 54.48,7.11 v54.61,6.99 | 52.96,2.41 52.86,2.51 U$6.P$5 52.86,6.25 52.96,6.35 | CR6.1 v48.01,7.11 | U6.20 44.06,14.44 U6.91 | Q2.3 36.14,18.8 39.12,18.8 R11.1 39.61,19.28 v41.15,19.28 | U$9.P$2 32.13,50.8 31.88,50.55 30.86,50.55 v30.73,50.42 v30.73,50.41
  Top 0.305: U$1.18 14.78,29.77 14.35,29.34 13.72,29.34 13.32,28.94 C33.2 | U$7.8 17.02,50.8 17.03,50.81 U$7.5 | U$7.2 18.53,50.79 U$7.25 | C16.2 16.5,56.13 C18.2
  Top 0.406: 25.26,48.77 C41.2 | U$11.2 66.29,49.66 65.83,50.12 U$8.P$12
  Top 0.508: C15.2 30.11,14.34 v29.58,14.87 28.19,14.87 | 28.19,14.87 C17.2 25.77,14.73 v25.02,14.73 | U1.2 28.19,14.87 | C27.2 v19.56,15.35 | v19.56,15.35 17.3,15.35 C28.2 C29.2 16.27,16.62 v16.26,16.64 | U5.2 v19.56,15.35 | Q1.3 35.94,15.18 v35.94,14.48
  Bottom 0.254: v21.29,32.69 21.34,32.64 | v62.1,10.84 62.1,10.79 | v41.15,19.28 41.15,19.3 | v30.73,50.41 v30.72,50.42 30.61,50.42
  Bottom 0.508: v19.56,15.35 19.56,15.37
  pour Bottom (rank 2): 89.66,79.12 89.66,-5.97 -17.14,-5.97 -17.14,79.12
  pour Top (rank 2): -18.67,76.83 87.76,76.83 87.76,-4.32 -18.67,-4.32
GPIO1  (via drill 0.38)
  Top 0.254: U10.1 67.51,32.95 R21.2 67.05,32.51 65.98,32.51 65.05,31.59 64.69,31.59 v63.97,30.86 | U6.16 45,18.84 v45.59,19.43
  Bottom 0.254: v45.59,19.43 56.26,19.43 63.44,26.61 63.44,27.88 63.97,28.41 v63.97,30.86
GPIO2  (via drill 0.38)
  Top 0.254: U9.1 67.51,29.14 R17.2 65.78,28.69 v64.52,27.43
  Bottom 0.254: U6.23 45.26,13.91 46.51,15.16 46.51,17.68 47.45,18.62 56.6,18.62 64.52,26.54 v64.52,27.43
  other vias: 45.26,12.39
GPIO3  (via drill 0.38)
  Top 0.254: U8.1 67.51,25.33 R15.2 64.95,24.88 v64.83,24.77
  Bottom 0.254: U6.24 46.36,14.44 46.91,15 46.91,17.51 47.62,18.21 56.77,18.21 63.32,24.77 v64.83,24.77
  other vias: 46.36,12.39
GPIO4  (via drill 0.38)
  Top 0.254: U7.1 67.51,21.52 R13.2 67.05,21.08 v64.64,21.08
  Bottom 0.254: U6.25 47.46,15.03 47.32,15.16 47.32,17.34 47.78,17.8 56.93,17.8 60.33,21.2 64.52,21.2 v64.64,21.08
  other vias: 47.46,12.39
GPIO5  (via drill 0.38)
  Top 0.254: U12.1 67.51,40.57 R25.2 66.54,40.12 v65.91,39.5 | U6.42 57.66,23.24 v57.78,23.11
  Bottom 0.254: v57.78,23.11 58.17,22.73 58.99,22.73 63.03,26.77 63.03,28.05 63.47,28.48 63.47,30.41 63.3,30.58 63.3,31.14 64.1,31.94 64.1,33.06 65.91,34.88 v65.91,39.5
GPIO6  (via drill 0.38)
  Top 0.254: U11.1 67.51,36.76 R23.2 66.79,36.31 66.17,35.69 66.17,34.37 66.47,34.07 66.47,33.5 66.07,33.1 65.61,33.1 v64.77,32.26 | U6.19 43.26,15.54 43.74,15.06 45.39,15.06 v45.42,15.03
  Bottom 0.254: v45.42,15.03 46.1,15.71 46.1,17.91 47.22,19.02 56.43,19.02 63.84,26.44 63.84,27.71 64.64,28.51 64.64,32.13 v64.77,32.26
GPS_POWER_EN  (via drill 0.38)
  Top 0.254: v30.86,8 30.99,8 30.99,6.99 31.37,6.6 SJ12.1
  Top 0.305: U$1.26 18.78,27.29 16.57,25.08 16.57,23.46 17.11,22.92 18.35,22.92 v18.41,22.86
  Bottom 0.254: 30.99,12.42 30.99,8.13 v30.86,8
  Bottom 0.305: v18.41,22.86 18.47,22.81 20.6,22.81 30.99,12.42
GPS_RX  (via drill 0.38)
  Top 0.254: 30.17,37.07 v30.23,37.01 29.85,37.01 29.77,36.93 26.76,36.93 26.61,37.07 U$1.42 | v40.51,37.72 48.77,37.72 49.91,38.86 49.91,41.27 50.8,42.16 57.15,42.16 58.93,43.94 JP4.4
  Top 0.305: SJ2.1 53.21,51.69 53.21,48.01 54.48,46.74 58.17,46.74 58.93,45.97 JP4.4
  Bottom 0.254: v30.23,37.01 39.81,37.01 v40.51,37.72
GPS_SCL  (via drill 0.38)
  Top 0.254: R32.2 9.66,36.57 U$1.8 20.06,36.57 v20.19,36.7
  Bottom 0.254: v20.19,36.7 29.59,36.7 29.95,36.34 30.5,36.34 30.77,36.61 39.12,36.61 39.24,36.61 58.58,36.61 64.01,42.04 JP4.2
  Bottom 0.305: SJ8.2 64.01,48.9 JP4.2
GPS_SDA  (via drill 0.38)
  Top 0.254: R33.2 8.89,36.07 U$1.9 19.26,36.07 v19.43,35.9 | v62.83,39.91 62.83,43.09 JP4.3
  Bottom 0.254: v19.43,35.9 20.41,35.9 20.8,36.3 29.42,36.3 29.78,35.94 30.67,35.94 30.94,36.2 59.12,36.2 v62.83,39.91
  Bottom 0.305: SJ9.2 59.05,51.44 61.47,49.02 JP4.3
GPS_TX  (via drill 0.38)
  Top 0.254: v30.99,37.95 30.72,37.69 29.95,37.69 29.6,37.34 26.92,37.34 26.69,37.57 U$1.43 | v39.7,38.24 40.08,38.24 40.23,38.39 40.86,38.39 41.12,38.12 48.54,38.12 49.4,38.99 49.4,41.53 50.44,42.57 55.37,42.57 56.39,43.59 JP4.5
  Top 0.305: SJ1.1 49.91,52.96 51.56,51.31 51.56,49.01 54.29,46.28 55.58,46.28 56.39,45.47 JP4.5
  Bottom 0.254: v30.99,37.95 31.37,37.95 31.86,37.47 39.24,37.47 39.7,37.93 v39.7,38.24
JTAG_RESET  (via drill 0.38)
  Top 0.254: v20.57,38.86 18.78,37.07 12.45,37.07 U$1.7 11.06,37.07 10.67,37.47 v10.29,37.47 | v44.83,40.51 44.83,41.85 J1.5 | S1.P$4 5.17,12.99 v4.45,13.72
  Bottom 0.254: v20.57,38.86 26.29,38.86 28.07,40.64 41.78,40.64 42.29,40.13 44.45,40.13 v44.83,40.51 | v4.45,13.72 3.65,14.52 3.65,19.96 3.94,20.26 3.94,24 3.91,24.03 3.91,25.19 5.69,26.96 5.69,30.98 7.24,32.52 7.24,36.51 6.18,37.57 6.18,38.12 6.58,38.52 7.14,38.52 8.19,37.47 v10.29,37.47
JTAG_SWCLK  (via drill 0.38)
  Top 0.254: U$1.49 23.19,42.02 23.31,42.14 26.95,42.14 v27.43,41.66 | v42.16,43.69 42.89,42.96 J1.3
  Bottom 0.254: v27.43,41.66 27.64,41.45 36.75,41.45 38.99,43.69 v42.16,43.69
JTAG_SWDIO  (via drill 0.38)
  Top 0.254: U$1.46 23.82,39.15 24.56,39.15 24.94,39.53 v26.01,39.53 | v37.85,41.31 39.86,41.31 40.41,40.77 41.53,40.77 41.89,41.13 J1.2
  Bottom 0.254: v26.01,39.53 26.39,39.53 27.9,41.05 37.58,41.05 v37.85,41.31
LORA_MISO  (via drill 0.38)
  Top 0.254: 18.28,45.85 18.11,46.02 v18.11,46.1
  Top 0.305: U$1.56 18.28,43.71 18.48,43.91 18.48,44.48 18.28,44.68 18.28,45.85 18.28,46.74 18.03,46.99 U$7.16
  Bottom 0.254: v18.11,46.1 17.59,46.1 17.57,46.08 5.93,46.08 3.23,48.77 JP1.3
LORA_MOSI  (via drill 0.38)
  Top 0.305: U$7.17 18.57,48.06 18.57,47.33 19.05,46.85 v19.05,45.97 | v17.78,44.2 U$1.57
  Bottom 0.254: JP1.2 5.08,46.23 5.84,45.47 17.1,45.47 17.61,44.96 17.61,44.37 v17.78,44.2
  Bottom 0.305: v19.05,45.97 19.05,45.47 v17.78,44.2
LORA_NSS  (via drill 0.38)
  Top 0.254: 20.57,48.01 v20.57,47.88 | v4.83,50.29 4.6,50.52 4.6,51.74 2.79,53.54 JP1.5
  Top 0.305: U$7.19 20.17,48.79 20.57,48.39 20.57,48.01 | v20.57,47.88 20.57,44.32 21.29,43.61 U$1.50
  Bottom 0.254: v20.57,47.88 20.47,47.78 19.34,47.78 19.19,47.62 16.07,47.62 15.77,47.92 15.02,47.92 14.1,46.99 8.13,46.99 v4.83,50.29
LORA_POWER_EN  (via drill 0.38)
  Top 0.254: U$1.23 17.3,30.62
  Top 0.305: v15.57,21.59 15.11,22.05 15.11,25.78 17.3,27.96 17.3,30.62 | v23.62,12.95 SJ11.1
  Bottom 0.305: v15.57,21.59 15.85,21.31 15.57,21.02 15.57,19.61 16.89,18.29 21.11,18.29 21.17,18.22 22.04,18.22 23.75,16.51 23.75,13.08 v23.62,12.95
LORA_SCK  (via drill 0.38)
  Top 0.254: v19.75,46.8 19.68,46.86
  Top 0.305: U$1.55 18.78,43.55 19.81,44.58 19.81,46.74 v19.75,46.8 | U$7.18 19.03,47.52 19.68,46.86
  Bottom 0.254: v19.75,46.8 17.72,46.8 17.4,46.48 6.6,46.48 4.6,48.49 4.6,49.2 3.99,49.81 3.28,49.81 2.79,50.29 2.79,50.67 JP1.4
MCU_USB_N
  Top 0.152: 31.59,38.81 J7.2
  Top 0.254: CR7.2 31.79,37.56 J7.2
  Top 0.305: U$1.44 25.05,38.07 25.07,38.09 28.07,38.09 28.19,37.97 | 28.19,37.97 | 28.19,37.97 28.2,37.97 29.34,37.97 29.35,37.97 | 29.35,37.97 | 29.35,37.97 30.19,38.81 31.59,38.81
MCU_USB_P
  Top 0.152: 32.3,39.62 J7.3
  Top 0.254: J7.3 CR8.2
  Top 0.305: 32.3,39.62 31.5,40.43 30.8,40.43 29.89,39.53 29.89,39.16 29.15,38.42 28.39,38.42 28.26,38.55 25.07,38.55 25.05,38.57 U$1.45
N$1
  Top 0.254: U$1.60 16.28,43.91 R2.1
N$4
  Top 0.305: U$8.P$2 51.69,55.62 51.05,56.26 SJ1.2
N$5
  Top 0.305: U$8.P$3 53.38,54.52 53.09,54.23 SJ2.2
N$6
  Top 0.203: U6.17 40.08,17.74 39.83,17.49 39.39,17.49 38.89,16.99 37.87,16.99 37.47,16.58 37.47,13.59 40.64,10.41 42.9,10.41 43.04,10.27 43.58,10.27 43.84,10.54
  Top 0.254: 43.84,10.54 46.1,10.54 46.99,9.65 46.99,6.35 47.37,5.97 49.45,5.97 50.24,5.17 50.24,5.13 50.29,5.08 50.29,4.46 U$6.P$1
N$7
  Top 0.305: U6.12 40,23.24 SJ6.2
N$8
  Top 0.305: U6.13 41.06,22.14 40.26,21.34 36.32,21.34 SJ7.2
N$9
  Top 0.508: U1.4 29.83,16.29 C15.1
N$10
  Top 0.508: U1.5 R3.1
N$11
  Top 0.508: U3.4 20.65,6.24 C19.1
N$12
  Top 0.254: U6.18 39.08,16.64 39.05,16.61 38.7,16.61 Q1.2
N$13
  Top 0.762: U6.56 X1.3
N$14
  Top 0.305: U$7.9 14.65,50.29 U$3.1
N$15
  Top 0.305: U$7.3 18.03,52.7 18.53,53.2 18.83,53.2 19.18,53.55 19.18,54.61 18.93,54.86 Y1.1 18.18,55.01 C16.1
N$16
  Top 0.305: U6.9 41.03,26.54 40.64,26.92 SJ3.2
N$17
  Top 0.305: U$7.4 17.53,53.3 Y1.3 16.87,53.96 C18.1
N$18
  Top 0.305: U6.11 35.86,24.34 SJ5.2
N$19
  Top 0.305: U6.10 39.84,25.44 SJ4.2
N$20
  Top 0.305: U2.2 25.75,26.01 26.54,26.8 R6.1
N$21
  Top 0.254: U$3.2 12.5,52.67 C48.2
  Top 0.305: U$7.7 15.64,51.29 15.24,51.69 15.24,51.94 14.52,52.67 U$3.2
N$24
  Top 0.254: U7.3 LED5.C
N$25
  Top 0.254: R14.1 73.65,21.59 LED5.A
N$26
  Top 0.254: U8.3 LED6.C
N$27
  Top 0.254: U$9.P$4 33.09,50.35 33.27,50.16 33.27,49.53 R4.2
  Top 0.406: C21.1 32.37,49.53 33.27,49.53
N$28
  Top 0.508: R8.1 U3.5
N$29
  Top 0.406: U$8.P$11 67.22,49.02 U$11.3
N$30
  Top 0.406: U$2.P$4 70.51,50.31 U$11.6
N$31
  Top 0.305: U2.1 24.36,27.8 R5.1
N$32
  Top 0.305: U2.7 22.5,22.76 R18.2
N$33
  Top 0.305: U2.8 23.12,22.11 R19.2
N$34
  Top 0.254: R16.1 73.65,25.4 LED6.A
N$35
  Top 0.254: U9.3 LED7.C
N$36
  Top 0.254: R20.1 73.65,29.21 LED7.A
N$37
  Top 0.254: U10.3 LED8.C
N$38
  Top 0.254: R22.1 73.65,33.02 LED8.A
N$39
  Top 0.254: U11.3 LED9.C
N$40
  Top 0.254: R24.1 73.65,36.83 LED9.A
N$41
  Top 0.254: U12.3 LED12.C
N$42
  Top 0.254: R26.1 73.65,40.64 LED12.A
N$43  (via drill 0.38)
  Top 0.305: U$8.P$17 62.35,55.62 v61.59,54.86
  Bottom 0.305: v61.59,54.86 61.59,53.09 SJ8.1
N$44  (via drill 0.38)
  Top 0.305: U$8.P$16 62.24,54.52 61.88,54.17 60.77,54.17 v60.07,54.86
  Bottom 0.305: v60.07,54.86 59.44,54.86 58.93,54.36 58.93,53.21 SJ9.1
N$45
  Top 0.508: R7.1 29.14,12.9 | 29.14,12.9 U1.3 | 29.14,12.9 29.76,12.9 30.44,13.58 31.1,13.58 31.43,13.91 32.2,13.91 SJ10.2
N$46
  Top 0.406: U$8.P$14 66.67,52.32 67.24,51.76 U$11.1
N$47
  Top 0.406: U$2.P$1 X3.P
N$48
  Top 0.508: SJ11.2 23.62,5.21 22.2,3.78 U3.3 20.51,2.98 20.07,2.54 R9.1
N$49
  Top 0.508: U1.6 27.19,16.34 R3.2 27.07,17.41 C22.1 J6.2
N$50
  Top 0.508: U3.6 18.55,6.44 R8.2 | C23.1 17.89,7.62 R8.2 | J2.2 R8.2
N$51
  Top 0.508: U4.4 29,6.75 C24.1
N$52
  Top 0.508: R12.1 27.93,6.64 U4.5
N$53
  Top 0.508: R28.1 28.45,2.79 28.89,3.24 | 28.89,3.24 U4.3 | SJ12.2 29.91,3.24 28.89,3.24
N$54_N
  Top 0.305: U6.28 50.76,12.04 51.08,11.72 51.08,10.03 50.69,9.64 R39.2
N$54_P
  Top 0.305: U6.29 51.86,12.04 51.53,11.72 51.53,10.05 R40.2
N$56
  Top 0.508: C26.1 26.62,7 U4.6 26.93,6.69 R12.2 J3.2
N$57
  Top 0.508: U5.4 21.73,16.54 C27.1
N$58
  Top 0.508: U5.5 R29.1
N$59
  Top 0.508: R30.1 20.07,12.7 20.51,13.14 U5.3 22.32,13.94 SJ13.2
N$60
  Top 0.508: U5.6 18.55,16.6 R29.2 18.44,17.92 C29.1 J4.2
N$61
  Top 1.27: U$17.2 12.45,6.35 11.7,7.1 J5.2
N$62
  Top 0.305: LED10.A R37.1
N$63
  Top 0.254: U14.P$8 12.25,16.7 R31.1
N$64
  pour Top (no thermals): 13.34,16.38 13.59,16.38 13.59,17.02 13.59,17.65 12.95,18.29 12.95,20.57 11.18,20.57 11.18,18.67 12.45,17.4 12.95,17.4 13.34,17.02
N$65
  Top 0.305: R38.1 LED11.A
N$66
  Top 0.305: R41.1 LED13.A
N$67
  Top 0.305: R42.1 LED14.A
N$68
  Top 0.254: U$1.1 8.95,40.07 SJ16.2
N$69
  Top 0.254: SJ17.2 7.39,34.57 U$1.12
N$70
  Top 0.254: SJ18.2 7.75,32.26 9.56,34.07 10.31,34.07 U$1.13
N$71
  Top 0.254: U$9.P$1 31.49,51.2 U$13.2
  Top 0.406: 31.38,52.29 C39.1
  Top 0.762: U$13.2 31.38,52.44 C39.1
N$72
  Top 0.305: U$7.21 20.44,49.79 21.35,48.88 U$14.1 | 22.61,48.88 C42.1
  Top 0.762: U$14.1 22.61,48.88
N$73
  Top 0.305: U$7.24 20.05,51.29 20.83,52.07 20.83,52.32 21.19,52.69 C1.1
  Top 0.406: 23.85,52.69 U$10.1
  Top 0.762: C1.1 C2.1 23.85,52.69
N$74
  Top 0.406: U$16.2 22.86,51.42 | 25.15,51.42 U$12.1
  Top 0.762: 22.86,51.42 U$10.2 25.15,51.42 | C3.1 U$12.1
N$75
  Top 0.406: 27.67,52.58 C37.1 | 27.69,51.42 C38.1
  Top 0.762: C3.2 U$12.2 C38.1 27.8,52.56 C37.1
N$76
  Top 0.305: U$7.22 21.48,50.29 U$14.2
  Top 0.762: U$14.2 22.72,50.18 C40.1
N$77
  Top 0.254: U$9.P$3 32.37,50.4 32,50.04 31.24,50.04 30.86,49.66
  Top 0.406: 24.13,49.93 C40.2 | 25.41,49.91 C41.1
  Top 0.508: 30.86,49.66 26.8,49.66 26.54,49.91 25.41,49.91
  Top 0.762: C41.1 24.02,49.93 C40.2
N$78
  Top 0.762: C38.2 U$13.1
N$79
  Top 0.406: U$15.1 C43.2 35.81,50.91
  Top 0.762: C44.1 35.7,52.04 C43.2
N$80
  Top 0.254: X2.P 42.42,55.75
  Top 0.406: 37.97,50.81 U$15.2
  Top 0.762: U$15.2 40.77,50.8 arc90 42.42,52.45 42.42,55.75 | C45.1 37.97,50.81
N$81
  Top 0.254: U$9.P$5 C43.1
N$82
  Top 0.305: U$7.23 20.43,50.79 20.95,51.31 U$16.1
N$83  (via drill 0.38)
  Top 0.254: U$1.27 19.28,32.41 18.25,33.44 15.6,33.44 15.2,33.05 15.2,32.98 v14.1,31.88 | v5.97,23.62 3.81,23.62 3.34,24.09 S5.P$3
  Bottom 0.254: v14.1,31.88 13.97,31.75 13.59,31.75 13.34,31.5 8.64,31.5 7.37,30.23 7.37,26.35 7.53,26.19 7.53,25.18 v5.97,23.62
N$84  (via drill 0.38)
  Top 0.254: v14.38,33.24 14.82,33.24 15.43,33.85 18.42,33.85 19.8,32.46 19.8,30.64 U$1.28 | v6.86,25.91 6.9,25.87 S4.P$3
  Bottom 0.254: v14.38,33.24 14.1,32.95 14.1,32.89 13.11,31.9 8.47,31.9 6.96,30.39 6.96,26.01 v6.86,25.91
N$85  (via drill 0.38)
  Top 0.254: v14.83,34.2 15.2,34.2 15.26,34.25 18.59,34.25 20.22,32.62 20.22,30.68 U$1.29 | S3.P$3 6.33,18.81 6.08,19.07 6.08,19.38 5.91,19.54 5.6,19.54 v5.33,19.81
  Bottom 0.254: v14.83,34.2 14.54,33.91 14.11,33.91 13.59,33.4 13.59,32.96 12.94,32.31 8.17,32.31 6.55,30.69 6.55,26.62 4.83,24.89 4.83,20.32 v5.33,19.81
N$86  (via drill 0.38)
  Top 0.254: U$1.30 20.8,30.64 20.8,31.33 20.7,31.43 20.7,32.34 20.63,32.41 20.63,32.78 18.75,34.66 15.32,34.66 15.11,34.87 14.55,34.87 14.34,34.66 14.11,34.66 v13.97,34.8 | v4.32,19.68 3.45,18.81 S2.P$3
  Bottom 0.254: v13.97,34.8 13.18,34.01 13.18,33.15 12.75,32.72 8,32.72 6.1,30.81 6.1,26.8 4.32,25.02 4.32,24.2 4.34,24.17 4.34,20.09 4.32,20.06 v4.32,19.68
N$87
  Top 0.305: LED1.C R1.1
N$88
  Top 0.305: LED2.C R34.1
N$89
  Top 0.305: LED3.C R35.1
N$90
  Top 0.305: LED4.C R36.1
N$91
  Top 0.305: R43.1 LED15.A
N$92
  Top 0.305: U$1.38 26.65,35.07 27.24,34.48 27.24,32.45 28.19,31.5 LED1.A
N$93
  Top 0.305: U$1.39 27.29,35.57 27.94,34.92 27.94,33.91 28.83,33.02 LED2.A
N$94
  Top 0.305: U$1.40 28.06,36.07 29.59,34.54 LED3.A
N$95
  Top 0.254: LED4.A 28.68,36.07 28.24,36.5 24.84,36.5 24.77,36.58 U$1.41
PACK+
  Top 0.508: R7.2 27.24,12.9 U1.1 26.02,13.69 C17.1 24.27,13.57 24,13.84 23.16,13.84 21.01,11.69 16.15,11.69 15.88,11.42
  Top 1.27: U$17.1 14.96,8.36 15.88,9.28 15.88,11.42 14.35,12.95 C30.1
  pour Top (no thermals): 13.34,14.99 14.1,14.99 14.1,14.48 14.1,14.35 14.48,13.97 14.48,12.45 14.22,12.19 13.34,12.19
SARA_CTS
  Top 0.305: U2.13 33.97,24.71 SJ5.1
SARA_POWER_ON
  Top 0.254: U6.15 38.73,19.94 Q2.2
SARA_RTS
  Top 0.305: U2.14 31.62,25.36 33.45,25.36 33.58,25.49 37.94,25.49 SJ4.1
SARA_RX
  Top 0.305: U2.11 31.58,23.41 33.15,21.84 SJ7.1
SARA_TX
  Top 0.305: U2.12 32.2,24.06 33.15,23.11 37.85,23.11 SJ6.1
SD_CS  (via drill 0.38)
  Top 0.254: U$1.33 24.79,32.57 25.12,32.24 25.12,31.99 25.51,31.59 25.77,31.59 v26.04,31.33 | v67.84,5.17 67.84,11.58 70.33,14.07 U$5.T2
  Bottom 0.254: v26.04,31.33 40.64,16.72 40.64,13.59 39.75,12.7 34.54,12.7 31.88,10.03 31.88,5.08 34.1,2.86 65.21,2.86 67.53,5.17 v67.84,5.17
SD_DET  (via drill 0.38)
  Top 0.254: v18.54,32 18.54,31.99 17.19,31.99 17.17,31.97 17.13,31.97 16.79,31.62 U$1.22 | v39.5,13.72 39.37,13.59 39.37,12.22 40.67,10.92 v43.31,10.92 | U$5.SW 60.88,15.5 R27.1 59.18,14.35 v59.31,14.22
  Bottom 0.254: v18.54,32 24.38,26.16 29.59,26.16 39.5,16.26 v39.5,13.72 | v43.31,10.92 59.05,10.92 59.31,11.18 v59.31,14.22
SD_MISO  (via drill 0.38)
  Top 0.254: v26.54,32.84 26.28,33.11 26.01,33.11 25.55,33.57 U$1.35 | 67.06,6.35 v67.06,6.39 65.38,8.06 U$5.T7
  Bottom 0.254: v26.54,32.84 27.46,31.93 27.46,31.16 41.55,17.06 41.55,13.17 40.17,11.79 34.9,11.79 32.89,9.78 32.89,5.59 34.66,3.82 64.91,3.82 67.06,5.97 v67.06,6.39
SD_MOSI  (via drill 0.38)
  Top 0.254: U$1.36 26,34.07 v26.29,33.78
  Top 0.305: v69.72,7.11 69.85,7.11 71.7,8.96 U$5.T3
  Bottom 0.254: v26.29,33.78 26.56,33.52 26.82,33.52 27.94,32.4 27.94,31.37 41.96,17.35 41.96,13 40.34,11.38 35.07,11.38 33.3,9.61 33.3,5.84 34.82,4.32 47.47,4.32 48.89,5.74 54.23,5.74 55.74,4.23 64.74,4.23 66.38,5.87 66.38,6.67 66.83,7.11 v69.72,7.11
SD_POWER_EN  (via drill 0.38)
  Top 0.305: U$1.24 17.78,27.69 15.62,25.53 15.62,22.73 v16.51,21.84 | v21.46,18.92 SJ13.1
  Bottom 0.305: v16.51,21.84 16.51,21.32 16.03,20.84 16.03,19.8 16.91,18.92 v21.46,18.92
SD_SCK  (via drill 0.38)
  Top 0.254: U$1.34 24.98,33.07 v25.79,32.27 | v71,6.99 71.17,7.16 U$5.T5
  Bottom 0.254: v25.79,32.27 26.06,32 26.31,32 27.05,31.26 27.05,30.99 41.15,16.89 41.15,13.34 40.01,12.19 34.67,12.19 32.38,9.91 32.38,5.33 34.42,3.3 65.02,3.3 67.56,5.84 69.85,5.84 v71,6.99
SIM_CLK
  Top 0.254: U$5.C3 C10.1 57.3,4.46 | 57.3,4.46 CR3.2 | 57.3,4.46 57.26,4.46 56.64,5.08 56.64,8.26 57.73,9.35 57.73,16.57 57.76,16.59 57.76,18.46 57.38,18.84 U6.38
SIM_IO
  Top 0.254: U$5.C7 58.51,7.16 C11.1 57.3,7.25 CR4.2 | CR4.2 | U6.39 56.65,19.9 57.47,19.9 58.17,19.2 58.17,16.42 58.14,16.4 58.14,9.23 58.17,9.2 58.17,8.89 57.28,8 CR4.2
SIM_RST  (via drill 0.38)
  Top 0.254: U6.40 61.64,21.04 68.07,14.61 v68.07,13.08 | v68.71,10.54 68.71,10.03 68.45,9.78 68.45,5.71 69.34,4.83 71.75,4.83 72.39,5.46 73.56,5.46 U$5.C2 75.86,5.36 C8.1 75.97,5.47 CR2.2
  Bottom 0.254: v68.07,13.08 68.71,12.45 v68.71,10.54
V_INT  (via drill 0.38)
  Top 0.254: v40.89,28.19 40.89,28.32 40.89,31.5 41.53,32.13 42.61,32.13 U6.4
  Top 0.305: U2.15 31.99,26.01 32.77,26.78 32.77,28.19 33.53,28.96 | 33.53,28.96 40.26,28.96 40.89,28.32 | 33.53,28.96 33.02,29.46 C14.1
VSIM  (via drill 0.38)
  Top 0.254: U$5.C1 73.79,4.46 | 73.79,4.46 74.66,4.46 75.95,3.17 C9.1 C7.1 77.47,3.31 CR1.2 | U6.41 57.49,22.14 58.19,21.44 61.81,21.44 68.48,14.77 68.48,14 v68.75,13.74 | v69.47,11.18 69.47,10.03 68.96,9.53 68.96,5.97 69.43,5.5 v71.12,5.5 | v72.64,4.45 73.77,4.45 73.79,4.46
  Bottom 0.254: v68.75,13.74 68.75,12.98 69.11,12.61 69.11,11.53 v69.47,11.18 | v71.12,5.5 72.17,4.45 v72.64,4.45

## Text on the board
tPlace: LoRa | 915MHz | GND | LoRa CS | LoRa SCK | LoRa MISO | GPS | LoRa MOSI | 1575 MHz | LoRa RESET | Debug | VBAT | Micro-B | GPS TX | GPS RX | GPS SDA | GPS SCL | SIM Detect | CTS | VSSA- | LED1 | RTS | LED2 | LED3 | RX | Network | Status | LED4 | TX | VDDA+ | GNSS EN | GND | 3 | 1 | GNSS Data | Ready | SD Power | 4 | 2 | Cell Power | SD EN | Cell EN | RESET | LoRa Power | GPS Power | ON | LoRa EN | GPS EN | OFF | SD | GPS | MAIN | LORA | CELL